# EasyEDA Pro project v1_SCH.epro

# Schematic VEX_Competition_Switch_Duo
Board Name: VEX_Competition_Switch_Duo; Create Date: 2025-08-25; Page Name: v1_SCH; Project Name: VEX_Competition_Switch_Duo; Schematic Name: VEX_Competition_Switch_Duo; Update Date: 2025-08-25; Add into BOM: yes; Company: Your Company; Convert to PCB: yes; Date: 2025-08-22; Draw By: noozabooz; REV: 1.0; Sheet: 1/1; spicePre: .
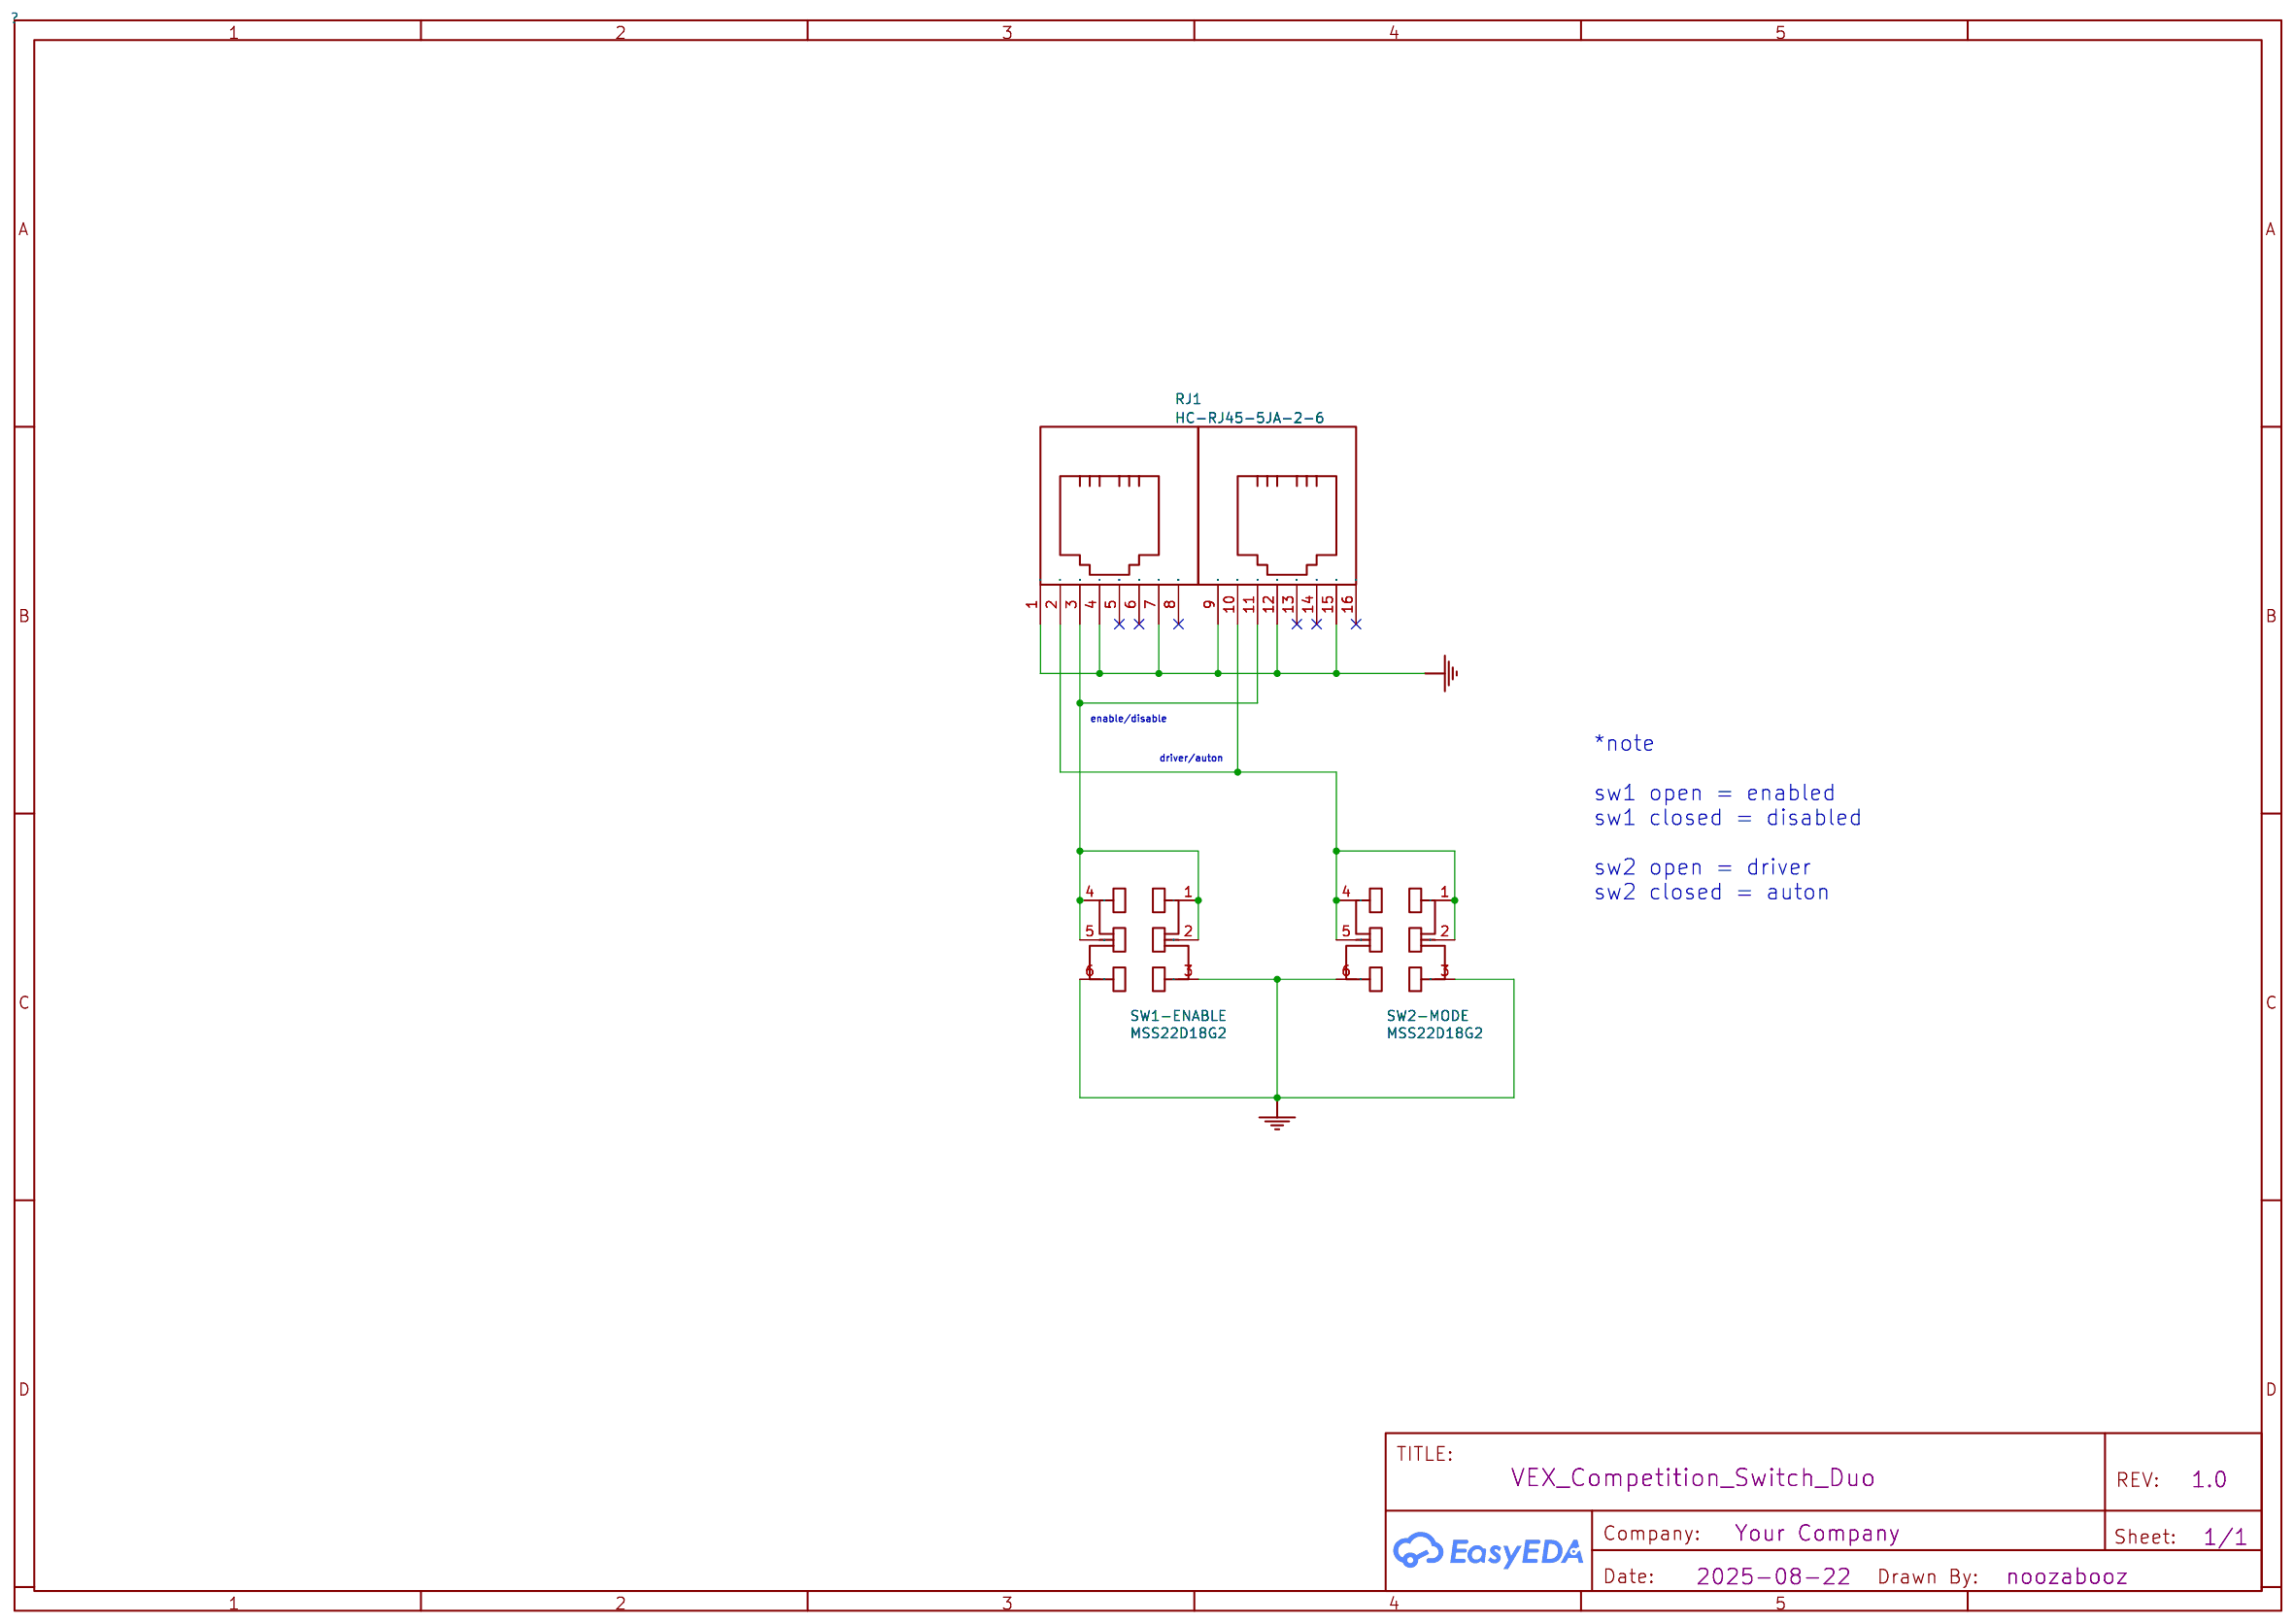
[diagram p0: schematic sheet]

## Parts
RJ1  HC-RJ45-5JA-2-6  [RJ45-TH_HC-RJ45-5JA-2-6-S]
SW1-ENABLE  MSS22D18G2  [SW-TH_MSS22D18GX]
SW2-MODE  MSS22D18G2  [SW-TH_MSS22D18GX]

## Library data of the parts
RJ1 = HC-RJ45-5JA-2-6: Supplier: LCSC; Supplier Part: C3000181; Manufacturer: HCTL(华灿天禄); Contributor: lcsc; spicePre: R
SW1-ENABLE SW2-MODE = MSS22D18G2: Supplier: LCSC; Supplier Part: C431542; Manufacturer: SHOU HAN(首韩); JLCPCB Part Class: Extended Part; Contributor: LCSC; spicePre: S

## Nets
GND: RJ1.1 RJ1.4 RJ1.7 RJ1.9 RJ1.12 RJ1.15 SW1-ENABLE.3 SW1-ENABLE.6 SW2-MODE.3 SW2-MODE.6
Net-(RJ1-2): RJ1.2 RJ1.10 SW2-MODE.1 SW2-MODE.2 SW2-MODE.4 SW2-MODE.5
Net-(RJ1-3): RJ1.3 RJ1.11 SW1-ENABLE.1 SW1-ENABLE.2 SW1-ENABLE.4 SW1-ENABLE.5

Not connected (* = marked no-connect by the designer): RJ1 5* 6* 8* 13* 14* 16*

## Notes on the sheet
- enable/disable
- *note
  sw1 open = enabled
  sw1 closed = disabled
  sw2 open = driver
  sw2 closed = auton
- driver/auton
